# EAGLE design FlyballETS-Board (EAGLE 8.3.0)
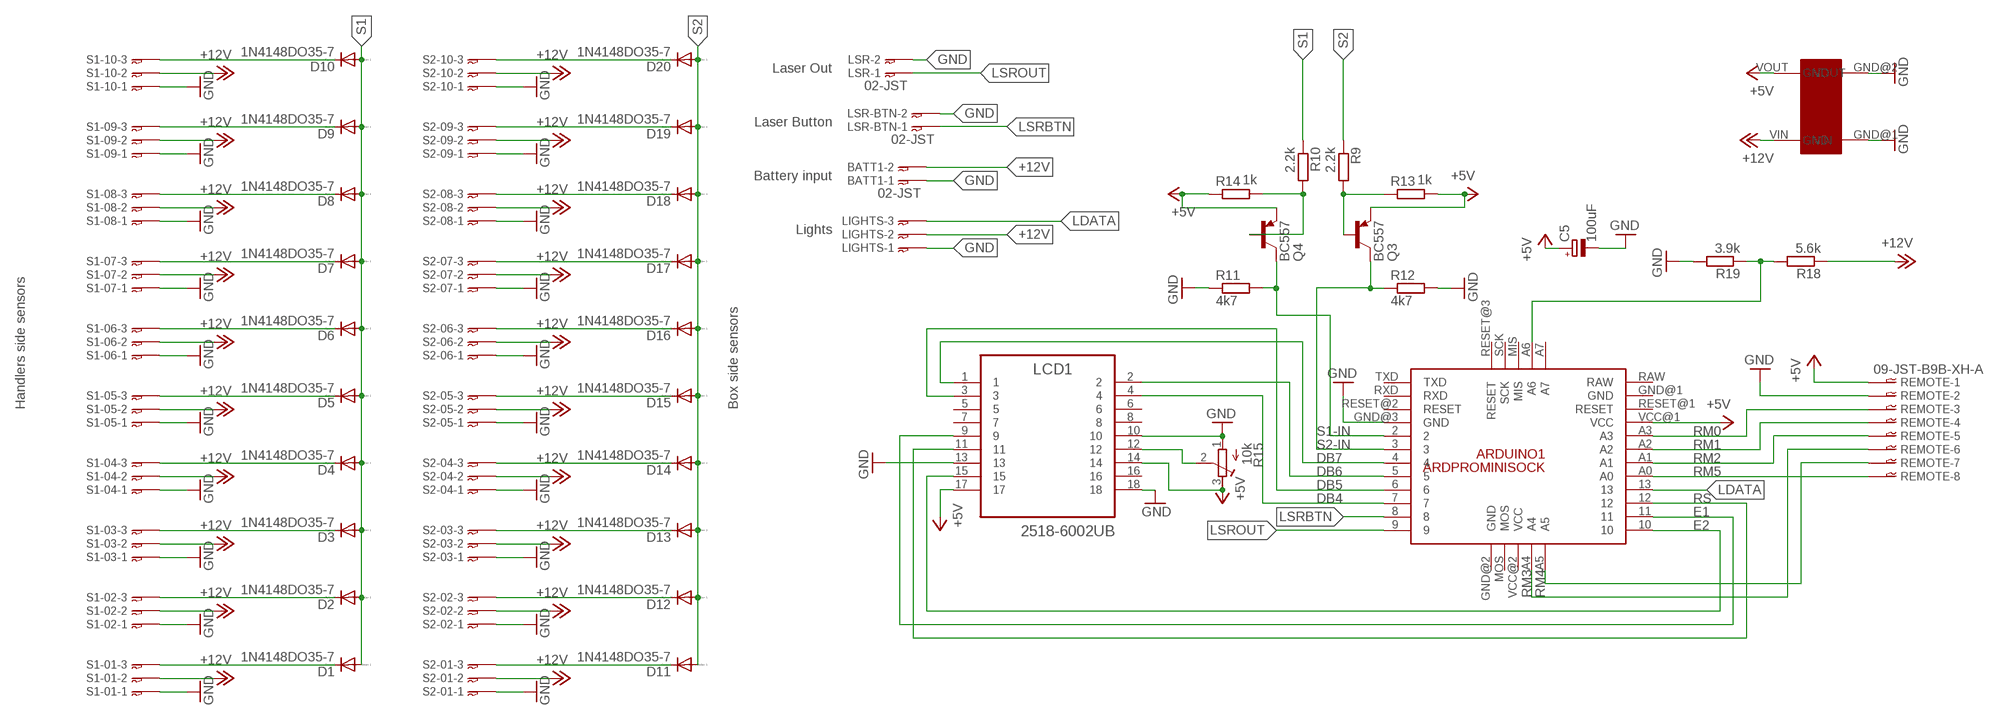
[diagram p0: schematic, sheet 1]

## Parts
ARDUINO1  ARDPROMINISOCK  [ARDPROMINISOCK]
BATT1  02-JST  [B2B-XH]
C5  100uF  CPOL-EUE2,5-6E  [E2,5-6E]
D1  1N4148DO35-7  [DO35-7]
D2  1N4148DO35-7  [DO35-7]
D3  1N4148DO35-7  [DO35-7]
D4  1N4148DO35-7  [DO35-7]
D5  1N4148DO35-7  [DO35-7]
D6  1N4148DO35-7  [DO35-7]
D7  1N4148DO35-7  [DO35-7]
D8  1N4148DO35-7  [DO35-7]
D9  1N4148DO35-7  [DO35-7]
D10  1N4148DO35-7  [DO35-7]
D11  1N4148DO35-7  [DO35-7]
D12  1N4148DO35-7  [DO35-7]
D13  1N4148DO35-7  [DO35-7]
D14  1N4148DO35-7  [DO35-7]
D15  1N4148DO35-7  [DO35-7]
D16  1N4148DO35-7  [DO35-7]
D17  1N4148DO35-7  [DO35-7]
D18  1N4148DO35-7  [DO35-7]
D19  1N4148DO35-7  [DO35-7]
D20  1N4148DO35-7  [DO35-7]
LCD1  2518-6002UB  [3M_2518-6002UB]
LIGHTS  03-JST-B3B-XH-A  [B3B-XH]
LSR  02-JST  [B2B-XH]
LSR-BTN  02-JST  [B2B-XH]
Q3  BC557  [TO92]
Q4  BC557  [TO92]
R9  2.2k  R-EU_0207/10  [0207/10]
R10  2.2k  R-EU_0207/10  [0207/10]
R11  4k7  R-EU_0207/10  [0207/10]
R12  4k7  R-EU_0207/10  [0207/10]
R13  1k  R-EU_0207/10  [0207/10]
R14  1k  R-EU_0207/10  [0207/10]
R15  10k  R-TRIMM3339P  [RTRIM3339P]
R18  5.6k  R-EU_0207/10  [0207/10]
R19  3.9k  R-EU_0207/10  [0207/10]
REMOTE  09-JST-B9B-XH-A  [B9B-XH]
S1-01  03-JST-B3B-XH-A  [B3B-XH]
S1-02  03-JST-B3B-XH-A  [B3B-XH]
S1-03  03-JST-B3B-XH-A  [B3B-XH]
S1-04  03-JST-B3B-XH-A  [B3B-XH]
S1-05  03-JST-B3B-XH-A  [B3B-XH]
S1-06  03-JST-B3B-XH-A  [B3B-XH]
S1-07  03-JST-B3B-XH-A  [B3B-XH]
S1-08  03-JST-B3B-XH-A  [B3B-XH]
S1-09  03-JST-B3B-XH-A  [B3B-XH]
S1-10  03-JST-B3B-XH-A  [B3B-XH]
S2-01  03-JST-B3B-XH-A  [B3B-XH]
S2-02  03-JST-B3B-XH-A  [B3B-XH]
S2-03  03-JST-B3B-XH-A  [B3B-XH]
S2-04  03-JST-B3B-XH-A  [B3B-XH]
S2-05  03-JST-B3B-XH-A  [B3B-XH]
S2-06  03-JST-B3B-XH-A  [B3B-XH]
S2-07  03-JST-B3B-XH-A  [B3B-XH]
S2-08  03-JST-B3B-XH-A  [B3B-XH]
S2-09  03-JST-B3B-XH-A  [B3B-XH]
S2-10  03-JST-B3B-XH-A  [B3B-XH]
U$2  LM2596-BOARD  [LM2596-BOARD]

## Nets
+5V: ARDUINO1.VCC@1(VCC) C5.+ LCD1.14 LCD1.17 Q3.1(E) Q4.1(E) R13.2 R14.1 R15.3(E) REMOTE.P$1 U$2.VOUT
+12V: BATT1.P$2 LIGHTS.P$2 R18.1 S1-01.P$2 S1-02.P$2 S1-03.P$2 S1-04.P$2 S1-05.P$2 S1-06.P$2 S1-07.P$2 S1-08.P$2 S1-09.P$2 S1-10.P$2 S2-01.P$2 S2-02.P$2 S2-03.P$2 S2-04.P$2 S2-05.P$2 S2-06.P$2 S2-07.P$2 S2-08.P$2 S2-09.P$2 S2-10.P$2 U$2.VIN
DB4: ARDUINO1.7 LCD1.4
DB5: ARDUINO1.6 LCD1.3
DB6: ARDUINO1.5 LCD1.2
DB7: ARDUINO1.4 LCD1.1
E1: ARDUINO1.11 LCD1.9
E2: ARDUINO1.10 LCD1.15
GND: ARDUINO1.GND@3(GND) BATT1.P$1 C5.- LCD1.10 LCD1.13 LCD1.18 LIGHTS.P$1 LSR-BTN.P$2 LSR.P$2 R11.1 R12.2 R15.1(A) R19.2 REMOTE.P$2 S1-01.P$1 S1-02.P$1 S1-03.P$1 S1-04.P$1 S1-05.P$1 S1-06.P$1 S1-07.P$1 S1-08.P$1 S1-09.P$1 S1-10.P$1 S2-01.P$1 S2-02.P$1 S2-03.P$1 S2-04.P$1 S2-05.P$1 S2-06.P$1 S2-07.P$1 S2-08.P$1 S2-09.P$1 S2-10.P$1 U$2.GND@1(GND) U$2.GND@2(GND)
LDATA: ARDUINO1.13 LIGHTS.P$3
LSRBTN: ARDUINO1.8 LSR-BTN.P$1
LSROUT: ARDUINO1.9 LSR.P$1
N$25: Q3.2(B) R9.2 R13.1
N$26: Q4.2(B) R10.2 R14.2
N$27: LCD1.12 R15.2(S)
N$72: D10.C S1-10.P$3
N$73: D9.C S1-09.P$3
N$74: D8.C S1-08.P$3
N$75: D7.C S1-07.P$3
N$76: D6.C S1-06.P$3
N$77: D5.C S1-05.P$3
N$78: D4.C S1-04.P$3
N$79: D3.C S1-03.P$3
N$80: D2.C S1-02.P$3
N$81: D1.C S1-01.P$3
N$82: D20.C S2-10.P$3
N$83: D19.C S2-09.P$3
N$84: D18.C S2-08.P$3
N$85: D17.C S2-07.P$3
N$86: D16.C S2-06.P$3
N$87: D15.C S2-05.P$3
N$88: D14.C S2-04.P$3
N$89: D13.C S2-03.P$3
N$90: D12.C S2-02.P$3
N$91: D11.C S2-01.P$3
RM0: ARDUINO1.A3 REMOTE.P$3
RM1: ARDUINO1.A2 REMOTE.P$4
RM2: ARDUINO1.A1 REMOTE.P$5
RM3: ARDUINO1.A4 REMOTE.P$6
RM4: ARDUINO1.A5 REMOTE.P$7
RM5: ARDUINO1.A0 REMOTE.P$8
RS: ARDUINO1.12 LCD1.11
S1: D1.A D2.A D3.A D4.A D5.A D6.A D7.A D8.A D9.A D10.A R10.1
S1-IN: ARDUINO1.2 Q4.3(C) R11.2
S2: D11.A D12.A D13.A D14.A D15.A D16.A D17.A D18.A D19.A D20.A R9.1
S2-IN: ARDUINO1.3 Q3.3(C) R12.1
VSENS: ARDUINO1.A6 R18.2 R19.1
Unconnected: ARDUINO1.A7 ARDUINO1.GND@1(GND) ARDUINO1.GND@2(GND) ARDUINO1.MIS ARDUINO1.MOS ARDUINO1.RAW ARDUINO1.RESET@1(RESET) ARDUINO1.RESET@2(RESET) ARDUINO1.RESET@3(RESET) ARDUINO1.RXD ARDUINO1.SCK ARDUINO1.TXD ARDUINO1.VCC@2(VCC) LCD1.5 LCD1.6 LCD1.7 LCD1.8 LCD1.16 REMOTE.P$9

## Notes on the sheet
- Laser Out
- Laser Button
- Battery input
- Lights
- Handlers side sensors | Box side sensors

## Library data of the parts
ARDUINO1 = _custom:ARDPROMINISOCK
BATT1 LSR LSR-BTN = bt_con-jst-xh:02-JST: JST CONNECTOR
C5 = resistor:CPOL-EU: POLARIZED CAPACITOR, European symbol
D1-D20 = diode:1N4148: DIODE high speed (Philips)
LCD1 = 3M_By_element14_Batch_1:2518-6002UB
LIGHTS S1-01-S1-09 S1-10 S2-01-S2-09 S2-10 = bt_con-jst-xh:03-JST: JST CONNECTOR
Q3 Q4 = transistor-pnp:BC557: PNP Transistor
R9-R14 R18 R19 = resistor:R-EU_: RESISTOR, European symbol
R15 = resistor:R-TRIMM: Trimm resistor
REMOTE = bt_con-jst-xh:09-JST: JST CONNECTOR
U$2 = _custom:LM2596-BOARD

## Net classes
0 default: clearance 0.205 mm

## Board
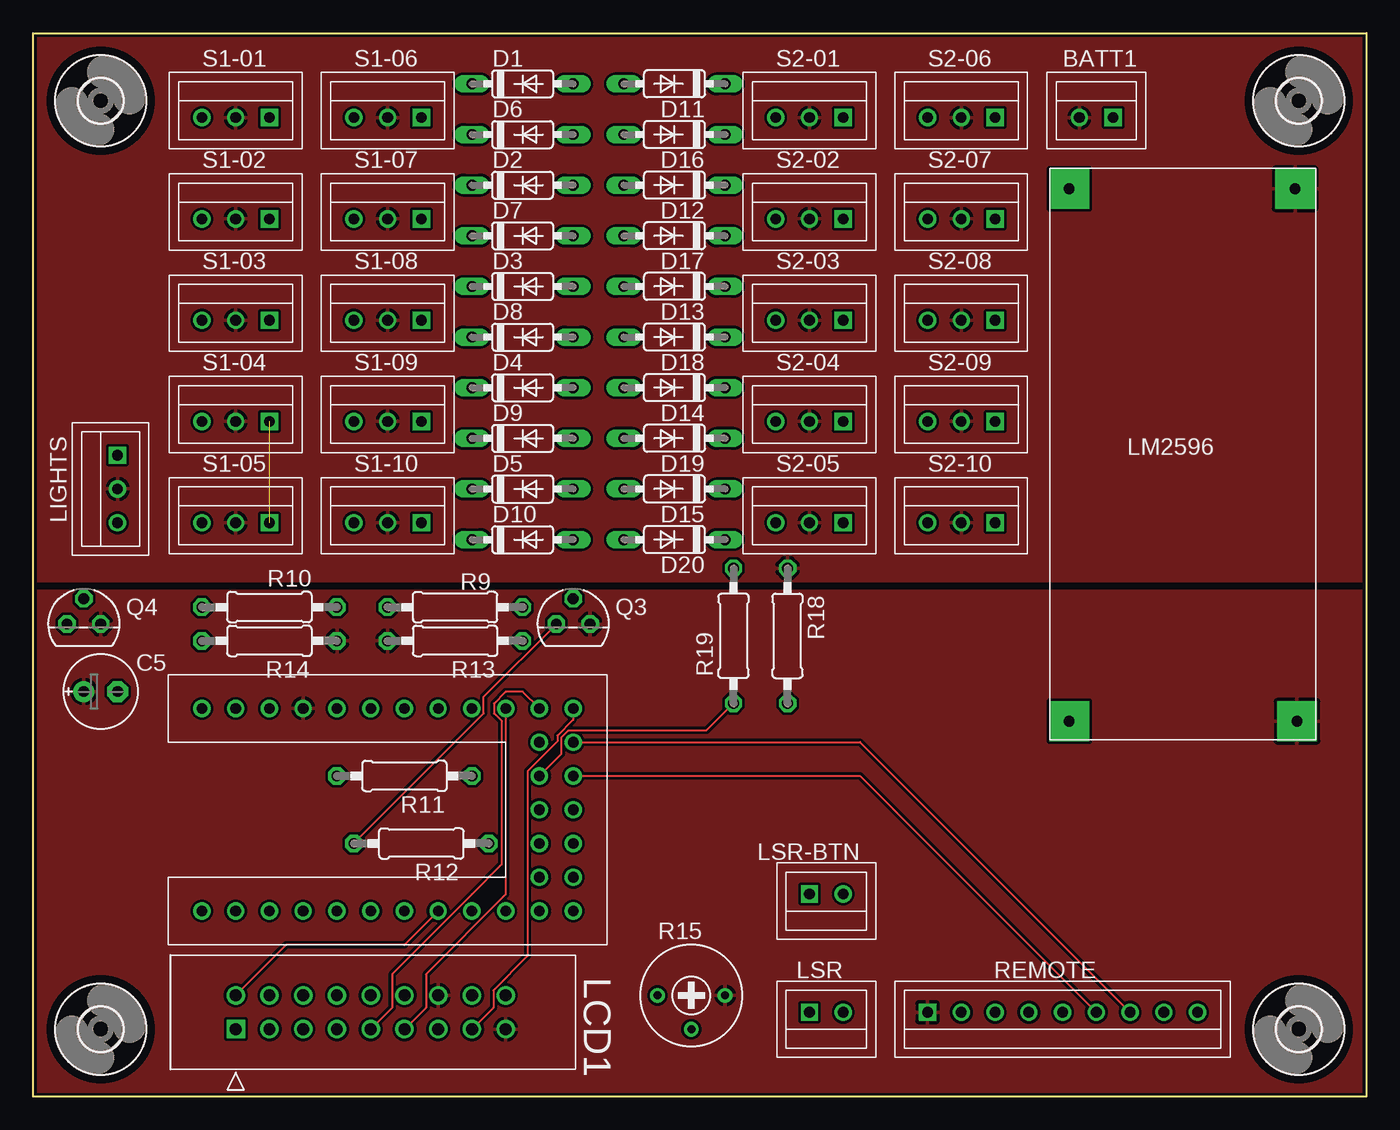
[diagram p1: board, top side]
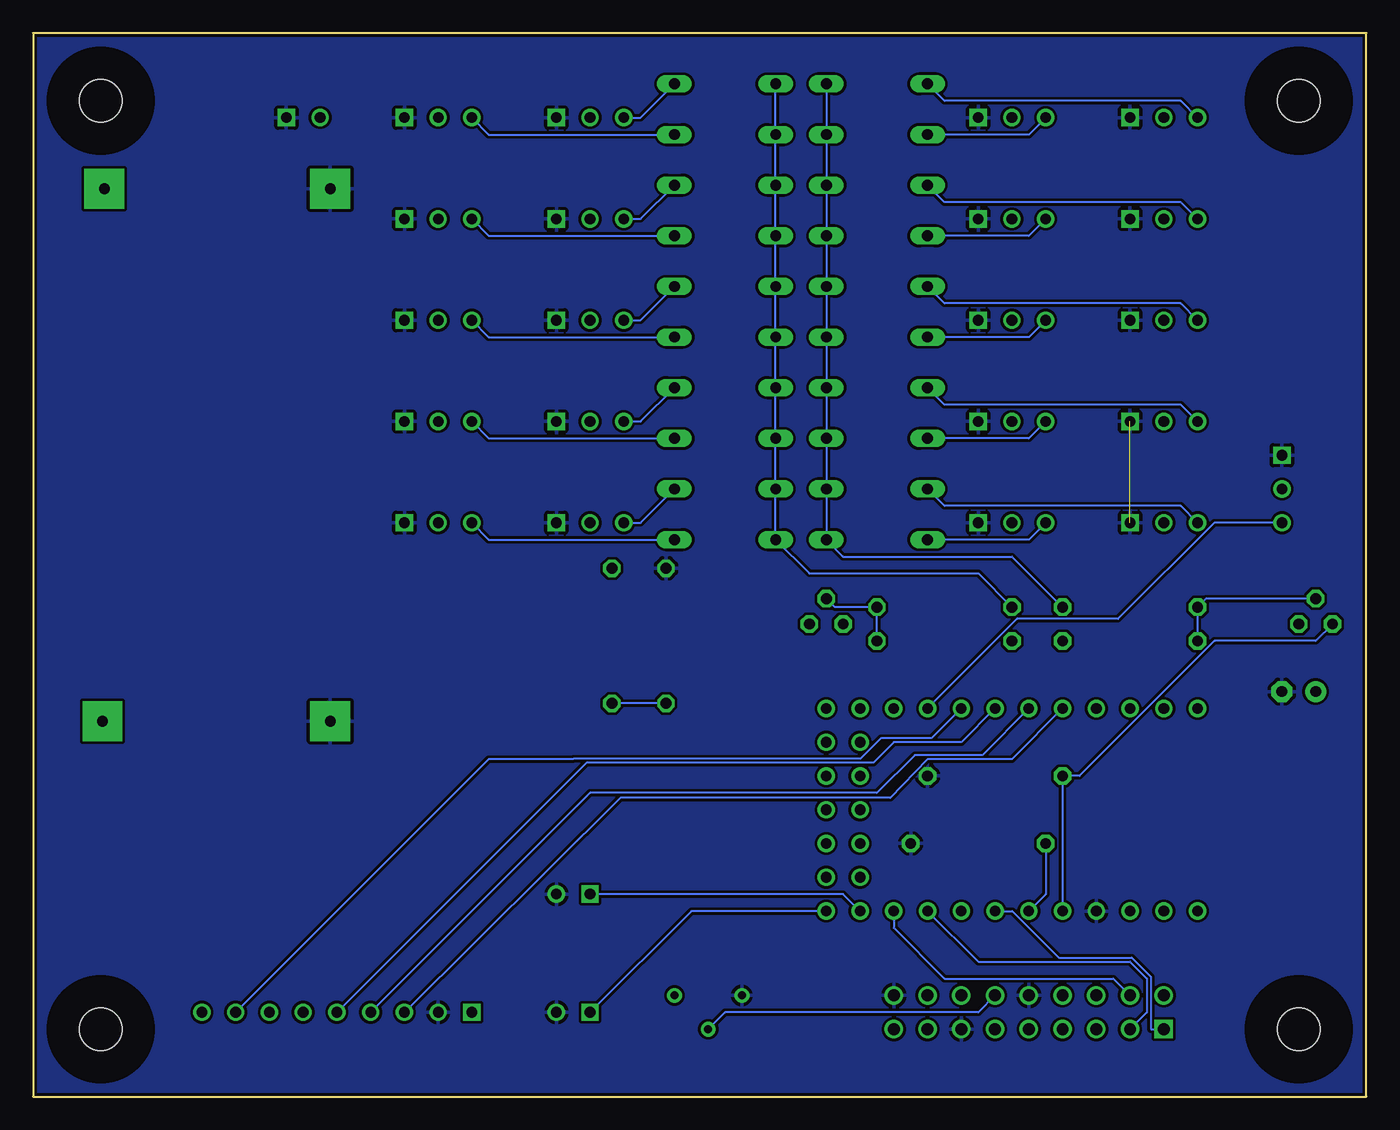
[diagram p2: board, bottom side, seen from below]

Size 100.33 x 80.01 mm. Coordinates in mm from the lower left corner, seen from the top.
Outline: 0,0 0,80.01 100.33,80.01 100.33,0 0,0
Copper layers (1*16): Top 0.035mm / dielectric 1.5mm / Bottom 0.035mm
Design rules "aisler_go_2layer": minimum track width 0.1mm, minimum drill 0.2mm, track to track 0.1mm, track to pad 0.1mm, pad to pad 0.1mm, via to via 0.1mm, smd to smd 0.1mm, copper to edge 0.2mm, drill to drill 0.21mm, minimum pad ring 0.25mm, minimum via ring 0.05mm, stop-mask expansion 0.05mm, vias tented up to drill 0mil, thermal gap 10mil

### Footprints (pad centres in the part's own frame; a part is rotated, then mirrored left to right if it is on the bottom)
ARDPROMINISOCK = drill 0.8: 2 17.78,12.7; 3 17.78,15.24; 4 17.78,17.78; 5 17.78,20.32; 6 17.78,22.86; 7 17.78,25.4; 8 17.78,27.94; 9 17.78,30.48; 10 2.54,30.48; 11 2.54,27.94; 12 2.54,25.4; 13 2.54,22.86; A0 2.54,20.32; A1 2.54,17.78; A2 2.54,15.24; A3 2.54,12.7; A4 7.62,30.48; A5 5.08,30.48; A6 7.62,27.94; A7 5.08,27.94; GND@1 2.54,5.08; GND@2 15.24,30.48; GND@3 17.78,10.16; MIS 10.16,27.94; MOS 12.7,30.48; RAW 2.54,2.54; RESET@1 2.54,7.62; RESET@2 15.24,27.94; RESET@3 17.78,7.62; RXD 17.78,5.08; SCK 12.7,27.94; TXD 17.78,2.54; VCC@1 2.54,10.16; VCC@2 10.16,30.48
B2B-XH = drill 0.8 square: P$1 2.54,0 | drill 0.8: P$2 0,0
E2,5-6E = drill 0.813 pad 1.575: + -1.27,0 | drill 0.813 pad 1.575 octagon: - 1.27,0
DO35-7 = drill 0.813 long: A 3.81,0; C -3.81,0
3M_2518-6002UB = drill 0.889 square: 1 0,2.54 | drill 0.889: 2 0,0; 3 -2.54,2.54; 4 -2.54,0; 5 -5.08,2.54; 6 -5.08,0; 7 -7.62,2.54; 8 -7.62,0; 9 -10.16,2.54; 10 -10.16,0; 11 -12.7,2.54; 12 -12.7,0; 13 -15.24,2.54; 14 -15.24,0; 15 -17.78,2.54; 16 -17.78,0; 17 -20.32,2.54; 18 -20.32,0
B3B-XH = drill 0.8 square: P$1 2.54,0 | drill 0.8: P$2 0,0; P$3 -2.54,0
TO92 = drill 0.813 octagon: 1 1.27,0; 2 0,1.905; 3 -1.27,0
0207/10 = drill 0.813 octagon: 1 -5.08,0; 2 5.08,0
RTRIM3339P = drill 0.61: 1 -2.54,0; 2 0,-2.54; 3 2.54,0
B9B-XH = drill 0.8 square: P$1 8.89,0 | drill 0.8: P$2 6.35,0; P$3 3.81,0; P$4 1.27,0; P$5 -1.27,0; P$6 -3.81,0; P$7 -6.35,0; P$8 -8.89,0; P$9 -11.43,0
3,2 = hole 3.2: 0,0
LM2596-BOARD = drill 0.8 pad 3 square: GND@1 18.55,1.54; GND@2 18.55,41.6; VIN 1.54,1.54; VOUT 1.405,41.6

### Placement (x,y rotation side)
ARDUINO1  10.16,31.75 270 top
BATT1  78.74,73.66 0 top
C5  5.08,30.48 0 top
D1  36.83,76.2 0 top
D2  36.83,68.58 0 top
D3  36.83,60.96 0 top
D4  36.83,53.34 0 top
D5  36.83,45.72 0 top
D6  36.83,72.39 0 top
D7  36.83,64.77 0 top
D8  36.83,57.15 0 top
D9  36.83,49.53 0 top
D10  36.83,41.91 0 top
D11  48.26,76.2 180 top
D12  48.26,68.58 180 top
D13  48.26,60.96 180 top
D14  48.26,53.34 180 top
D15  48.26,45.72 180 top
D16  48.26,72.39 180 top
D17  48.26,64.77 180 top
D18  48.26,57.15 180 top
D19  48.26,49.53 180 top
D20  48.26,41.91 180 top
LCD1  15.24,7.62 180 top
LIGHTS  6.35,45.72 90 top
LSR  60.96,6.35 180 top
LSR-BTN  60.96,15.24 180 top
Q3  40.64,35.56 0 top
Q4  3.81,35.56 0 top
R9  31.75,36.83 0 top
R10  17.78,36.83 180 top
R11  27.94,24.13 180 top
R12  29.21,19.05 0 top
R13  31.75,34.29 180 top
R14  17.78,34.29 180 top
R15  49.53,7.62 0 top
R18  56.77,34.67 270 top
R19  52.7,34.67 90 top
REMOTE  76.2,6.35 180 top
S1-01  15.24,73.66 0 top
S1-02  15.24,66.04 0 top
S1-03  15.24,58.42 0 top
S1-04  15.24,50.8 0 top
S1-05  15.24,43.18 0 top
S1-06  26.67,73.66 0 top
S1-07  26.67,66.04 0 top
S1-08  26.67,58.42 0 top
S1-09  26.67,50.8 0 top
S1-10  26.67,43.18 0 top
S2-01  58.42,73.66 0 top
S2-02  58.42,66.04 0 top
S2-03  58.42,58.42 0 top
S2-04  58.42,50.8 0 top
S2-05  58.42,43.18 0 top
S2-06  69.85,73.66 0 top
S2-07  69.85,66.04 0 top
S2-08  69.85,58.42 0 top
S2-09  69.85,50.8 0 top
S2-10  69.85,43.18 0 top
U$1  [3,2]  5.08,74.93 0 top
U$2  96.52,69.85 180 top
U$3  [3,2]  95.25,74.93 0 top
U$4  [3,2]  95.25,5.08 0 top
U$5  [3,2]  5.08,5.08 0 top

### Tracks (layer width: path | path; a pad name or v marks a point on that pad's centre or on a via)
+5V
  pour Top: 0,0 0,38.1 100.33,38.1 100.33,0
+12V
  pour Top: 0,80.01 100.33,80.01 100.33,38.73 0,38.73
DB4
  Bottom 0.152: ARDUINO1.7 35.56,12.7 31.75,8.89 19.05,8.89 LCD1.4
DB5
  Bottom 0.152: ARDUINO1.6 29.21,10.16 17.78,10.16 16.51,8.89 16.51,6.35 LCD1.3
DB6
  Top 0.152: ARDUINO1.5 27.94,11.43 19.05,11.43 LCD1.2
DB7
  Bottom 0.152: ARDUINO1.4 26.65,13.97 23.14,10.46 17.65,10.46 16.2,9.02 16.2,5.08 LCD1.1
E1
  Top 0.152: ARDUINO1.11 36.83,30.48 35.56,30.48 35.56,30.46 34.68,29.58 34.68,28.84 35.26,28.27 35.26,17.48 33.02,15.24 33.02,15.22 27.01,9.21 27.01,6.69 LCD1.9
E2
  Top 0.152: ARDUINO1.10 40.64,28.35 39.45,27.16 39.45,26.73 37.22,24.5 37.22,10.59 34.63,8 34.63,6.69 LCD1.15
GND  (1 unrouted)
  pour Bottom: 0,80.01 100.33,80.01 100.33,0 0,0
LDATA
  Bottom 0.152: LIGHTS.P$3 11.45,43.18 18.69,35.94 26.29,35.94 ARDUINO1.13
LSRBTN
  Bottom 0.152: ARDUINO1.8 39.37,15.24 LSR-BTN.P$1
LSROUT
  Bottom 0.152: ARDUINO1.9 50.8,13.97 LSR.P$1
N$25
  Bottom 0.152: R13.1 R9.2 40.01,36.83 Q3.2
N$26
  Bottom 0.152: R14.2 R10.2 12.06,37.47 Q4.2
N$27
  Bottom 0.152: LCD1.12 29.21,6.35 48.26,6.35 R15.2
N$72
  Bottom 0.152: S1-10.P$3 25.4,41.91 D10.C
N$73
  Bottom 0.152: S1-09.P$3 25.4,49.53 D9.C
N$74
  Bottom 0.152: S1-08.P$3 25.4,57.15 D8.C
N$75
  Bottom 0.152: S1-07.P$3 25.4,64.77 D7.C
N$76
  Bottom 0.152: S1-06.P$3 25.4,72.39 D6.C
N$77
  Bottom 0.152: S1-05.P$3 13.97,44.45 31.75,44.45 D5.C
N$78
  Bottom 0.152: S1-04.P$3 13.97,52.07 31.75,52.07 D4.C
N$79
  Bottom 0.152: S1-03.P$3 13.97,59.69 31.75,59.69 D3.C
N$80
  Bottom 0.152: S1-02.P$3 13.97,67.31 31.75,67.31 D2.C
N$81
  Bottom 0.152: S1-01.P$3 13.97,74.93 31.75,74.93 D1.C
N$82
  Bottom 0.152: S2-10.P$3 66.04,41.91 D20.C
N$83
  Bottom 0.152: S2-09.P$3 66.04,49.53 D19.C
N$84
  Bottom 0.152: S2-08.P$3 66.04,57.15 D18.C
N$85
  Bottom 0.152: S2-07.P$3 66.04,64.77 D17.C
N$86
  Bottom 0.152: S2-06.P$3 66.04,72.39 D16.C
N$87
  Bottom 0.152: S2-05.P$3 54.61,43.18 D15.C
N$88
  Bottom 0.152: S2-04.P$3 54.61,50.8 D14.C
N$89
  Bottom 0.152: S2-03.P$3 54.61,58.42 D13.C
N$90
  Bottom 0.152: S2-02.P$3 54.61,66.04 D12.C
N$91
  Bottom 0.152: S2-01.P$3 54.61,73.66 D11.C
RM0
  Bottom 0.152: ARDUINO1.A3 26.67,25.4 33.02,25.4 35.81,22.48 56.13,22.48 REMOTE.P$3
RM1
  Bottom 0.152: ARDUINO1.A2 28.91,25.7 33.98,25.7 36.83,22.86 58.42,22.86 REMOTE.P$4
RM2
  Bottom 0.152: ARDUINO1.A1 30.48,26.67 35.56,26.67 37.09,25.14 58.69,25.14 REMOTE.P$5
RM3
  Top 0.152: ARDUINO1.A4 62.23,24.13 REMOTE.P$6
RM4
  Top 0.152: ARDUINO1.A5 62.23,26.67 REMOTE.P$7
RM5
  Bottom 0.152: ARDUINO1.A0 32.72,26.98 36.52,26.98 38.06,25.44 59.65,25.44 59.69,25.4 66.04,25.4 REMOTE.P$8
RS
  Top 0.152: ARDUINO1.12 35.56,15.22 29.55,9.21 29.55,6.69 LCD1.11
S1
  Bottom 0.152: 40.62,41.89 D10.A | 40.62,41.89 39.37,40.64 26.67,40.64 R10.1 | D1.A D6.A D2.A D7.A D3.A D8.A D4.A D9.A D5.A D10.A | D10.A 40.62,41.89
S1-IN
  Bottom 0.152: Q4.3 3.81,34.29 11.43,34.29 21.59,24.13 R11.2 ARDUINO1.2
S2
  Bottom 0.152: R9.1 29.21,39.37 41.91,39.37 D20.A D15.A D19.A D14.A D18.A D13.A D17.A D12.A D16.A D11.A
S2-IN
  Top 0.152: Q3.3 33.9,30.09 33.9,28.84 24.13,19.07 R12.1
  Bottom 0.152: R12.1 24.13,15.24 ARDUINO1.3
VSENS
  Top 0.152: R19.1 50.67,27.55 40.27,27.55 39.76,27.04 39.76,25.79 ARDUINO1.A6
  Bottom 0.152: R19.1 R18.2

### Text on the board
tDocu: FlyballETS Board v4.0.0 / http://bit.ly/FBETS / LICENSE: CC-BY-SA